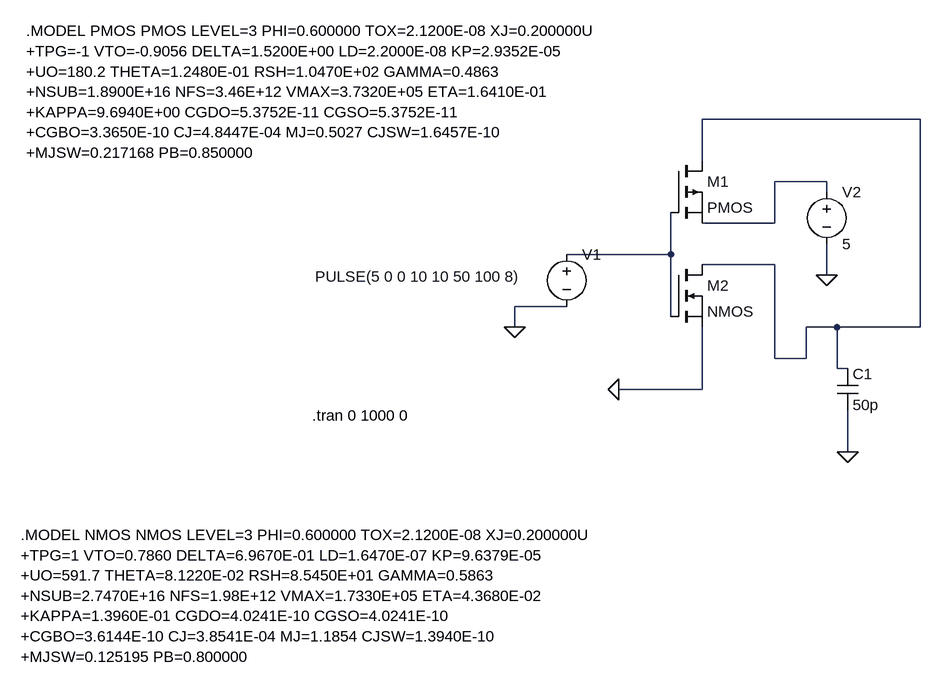
[diagram p0: schematic cmos_not_50pF_typ_sqmtc.asc]
cmos_not_50pF_typ_sqmtc.asc, the LTspice schematic file:
Version 4
SHEET 1 4716 1876
WIRE 544 0 208 0
WIRE 208 64 208 0
WIRE 400 96 320 96
WIRE 400 112 400 96
WIRE 320 160 320 96
WIRE 320 160 208 160
WIRE 160 208 160 144
WIRE 160 208 0 208
WIRE 320 224 208 224
WIRE 400 240 400 192
WIRE 0 288 -80 288
WIRE 160 304 160 208
WIRE -80 320 -80 288
WIRE 416 320 368 320
WIRE 544 320 544 0
WIRE 544 320 416 320
WIRE 320 368 320 224
WIRE 368 368 368 320
WIRE 368 368 320 368
WIRE 416 384 416 320
WIRE 432 384 416 384
WIRE 208 416 208 320
WIRE 208 416 80 416
WIRE 432 512 432 448
FLAG 80 416 0
FLAG 432 512 0
FLAG 400 240 0
FLAG -80 320 0
DATAFLAG 416 320 ""
DATAFLAG 432 480 ""
DATAFLAG 416 368 ""
DATAFLAG 544 160 ""
DATAFLAG 320 256 ""
DATAFLAG 160 416 ""
DATAFLAG -64 288 ""
DATAFLAG 160 208 ""
DATAFLAG 320 96 ""
DATAFLAG 208 32 ""
DATAFLAG 176 272 ""
SYMBOL pmos 160 64 R0
SYMATTR InstName M1
SYMBOL nmos 160 224 R0
SYMATTR InstName M2
SYMBOL voltage 0 192 R0
WINDOW 3 -387 50 Left 2
WINDOW 123 0 0 Left 0
WINDOW 39 0 0 Left 0
SYMATTR Value PULSE(5 0 0 10 10 50 100 8)
SYMATTR InstName V1
SYMBOL voltage 400 96 R0
WINDOW 123 0 0 Left 0
WINDOW 39 0 0 Left 0
SYMATTR InstName V2
SYMATTR Value 5
SYMBOL cap 416 384 R0
SYMATTR InstName C1
SYMATTR Value 50p
TEXT -392 456 Left 2 !.tran 0 1000 0
TEXT -840 640 Left 2 !.MODEL NMOS NMOS LEVEL=3 PHI=0.600000 TOX=2.1200E-08 XJ=0.200000U \n+TPG=1 VTO=0.7860 DELTA=6.9670E-01 LD=1.6470E-07 KP=9.6379E-05 \n+UO=591.7 THETA=8.1220E-02 RSH=8.5450E+01 GAMMA=0.5863 \n+NSUB=2.7470E+16 NFS=1.98E+12 VMAX=1.7330E+05 ETA=4.3680E-02 \n+KAPPA=1.3960E-01 CGDO=4.0241E-10 CGSO=4.0241E-10\n+CGBO=3.6144E-10 CJ=3.8541E-04 MJ=1.1854 CJSW=1.3940E-10 \n+MJSW=0.125195 PB=0.800000
TEXT -832 -136 Left 2 !.MODEL PMOS PMOS LEVEL=3 PHI=0.600000 TOX=2.1200E-08 XJ=0.200000U \n+TPG=-1 VTO=-0.9056 DELTA=1.5200E+00 LD=2.2000E-08 KP=2.9352E-05 \n+UO=180.2 THETA=1.2480E-01 RSH=1.0470E+02 GAMMA=0.4863 \n+NSUB=1.8900E+16 NFS=3.46E+12 VMAX=3.7320E+05 ETA=1.6410E-01 \n+KAPPA=9.6940E+00 CGDO=5.3752E-11 CGSO=5.3752E-11\n+CGBO=3.3650E-10 CJ=4.8447E-04 MJ=0.5027 CJSW=1.6457E-10 \n+MJSW=0.217168 PB=0.850000

The netlist it stands for:
* cmos_not_50pF_typ_sqmtc.asc
M1 N001 N003 N002 N002 PMOS
M2 N001 N003 0 0 NMOS
V1 N003 0 PULSE(5 0 0 10 10 50 100 8)
V2 N002 0 5
C1 N001 0 50p
.model NMOS NMOS
.model PMOS PMOS
.lib standard.mos
.tran 0 1000 0
.MODEL NMOS NMOS LEVEL=3 PHI=0.600000 TOX=2.1200E-08 XJ=0.200000U
+TPG=1 VTO=0.7860 DELTA=6.9670E-01 LD=1.6470E-07 KP=9.6379E-05
+UO=591.7 THETA=8.1220E-02 RSH=8.5450E+01 GAMMA=0.5863
+NSUB=2.7470E+16 NFS=1.98E+12 VMAX=1.7330E+05 ETA=4.3680E-02
+KAPPA=1.3960E-01 CGDO=4.0241E-10 CGSO=4.0241E-10
+CGBO=3.6144E-10 CJ=3.8541E-04 MJ=1.1854 CJSW=1.3940E-10
+MJSW=0.125195 PB=0.800000
.MODEL PMOS PMOS LEVEL=3 PHI=0.600000 TOX=2.1200E-08 XJ=0.200000U
+TPG=-1 VTO=-0.9056 DELTA=1.5200E+00 LD=2.2000E-08 KP=2.9352E-05
+UO=180.2 THETA=1.2480E-01 RSH=1.0470E+02 GAMMA=0.4863
+NSUB=1.8900E+16 NFS=3.46E+12 VMAX=3.7320E+05 ETA=1.6410E-01
+KAPPA=9.6940E+00 CGDO=5.3752E-11 CGSO=5.3752E-11
+CGBO=3.3650E-10 CJ=4.8447E-04 MJ=0.5027 CJSW=1.6457E-10
+MJSW=0.217168 PB=0.850000
.backanno
.end